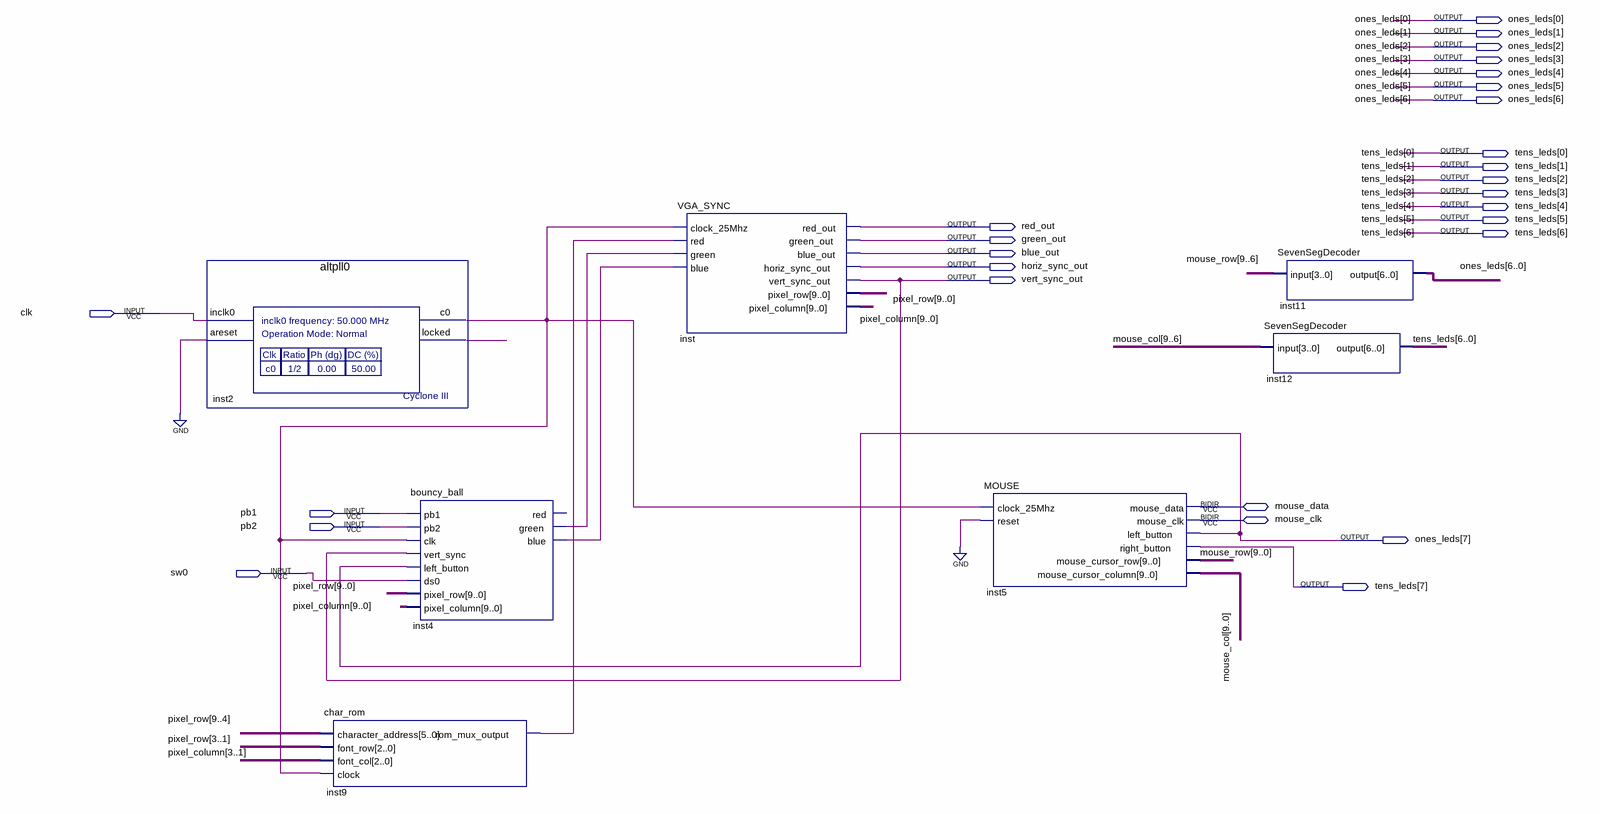
[diagram p0: schematic sheet]
// Quartus schematic interimCode.bdf as structural Verilog: 7 symbols, 27 pins
module interimCode (
  input  clk,
  input  pb1,
  input  pb2,
  input  sw0,
  inout  mouse_data,
  inout  mouse_clk,
  output [7:0] ones_leds,
  output [7:0] tens_leds,
  output red_out,
  output green_out,
  output blue_out,
  output horiz_sync_out,
  output vert_sync_out
);

  wire inst2_c0, inst2_locked, inst4_blue, inst4_green, inst9_rom_mux_output;
  wire [9:0] mouse_col, mouse_row, pixel_column, pixel_row;

  altpll0 inst2 (.inclk0(clk), .areset(1'b0), .c0(inst2_c0), .locked(inst2_locked));
  char_rom inst9 (
    .character_address(pixel_row[9:4]), .font_row(pixel_row[3:1]), .font_col(pixel_column[3:1]),
    .clock(inst2_c0), .rom_mux_output(inst9_rom_mux_output));
  bouncy_ball inst4 (
    .pb1(pb1), .pb2(pb2), .clk(inst2_c0), .vert_sync(vert_sync_out), .left_button(ones_leds[7]), .ds0(sw0),
    .pixel_row(pixel_row), .pixel_column(pixel_column), .green(inst4_green), .blue(inst4_blue));  // open: red
  VGA_SYNC inst (
    .clock_25Mhz(inst2_c0), .red(inst9_rom_mux_output), .green(inst4_green), .blue(inst4_blue),
    .red_out(red_out), .green_out(green_out), .blue_out(blue_out), .horiz_sync_out(horiz_sync_out),
    .vert_sync_out(vert_sync_out), .pixel_row(pixel_row), .pixel_column(pixel_column));
  MOUSE inst5 (
    .clock_25Mhz(inst2_c0), .reset(1'b0), .left_button(ones_leds[7]), .right_button(tens_leds[7]),
    .mouse_cursor_row(mouse_row), .mouse_cursor_column(mouse_col), .mouse_data(mouse_data),
    .mouse_clk(mouse_clk));
  SevenSegDecoder inst12 (.\input (mouse_col[9:6]), .\output (tens_leds[6:0]));
  SevenSegDecoder inst11 (.\input (mouse_row[9:6]), .\output (ones_leds[6:0]));
endmodule
